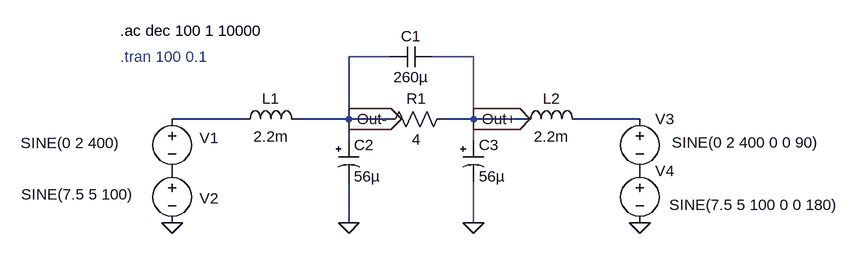
[diagram p0: schematic filterSim.asc]
filterSim.asc, the LTspice schematic file:
Version 4
SHEET 1 1072 680
WIRE 352 208 288 208
WIRE 480 208 416 208
WIRE 128 304 16 304
WIRE 288 304 288 208
WIRE 288 304 208 304
WIRE 352 304 288 304
WIRE 480 304 480 208
WIRE 480 304 432 304
WIRE 560 304 480 304
WIRE 736 304 640 304
WIRE 288 336 288 304
WIRE 480 336 480 304
WIRE 288 464 288 400
WIRE 480 464 480 400
FLAG 16 464 0
FLAG 736 464 0
FLAG 288 464 0
FLAG 480 464 0
FLAG 288 304 Out-
IOPIN 288 304 Out
FLAG 480 304 Out+
IOPIN 480 304 Out
SYMBOL ind 112 320 R270
WINDOW 0 32 56 VTop 2
WINDOW 3 5 56 VBottom 2
SYMATTR InstName L1
SYMATTR Value 2.2m
SYMBOL ind 544 320 R270
WINDOW 0 32 56 VTop 2
WINDOW 3 5 56 VBottom 2
SYMATTR InstName L2
SYMATTR Value 2.2m
SYMBOL cap 352 224 R270
WINDOW 0 32 32 VTop 2
WINDOW 3 0 32 VBottom 2
SYMATTR InstName C1
SYMATTR Value 260µ
SYMBOL polcap 272 336 R0
SYMATTR InstName C2
SYMATTR Value 56µ
SYMBOL polcap 464 336 R0
SYMATTR InstName C3
SYMATTR Value 56µ
SYMBOL res 448 288 R90
WINDOW 0 0 56 VBottom 2
WINDOW 3 32 56 VTop 2
SYMATTR InstName R1
SYMATTR Value 4
SYMBOL voltage 16 368 R0
WINDOW 0 42 58 Left 2
WINDOW 3 -232 52 Left 2
SYMATTR InstName V2
SYMATTR Value SINE(7.5 5 100)
SYMATTR Value2 AC 1
SYMBOL voltage 736 368 R0
WINDOW 3 45 68 Left 2
SYMATTR Value SINE(7.5 5 100 0 0 180)
SYMATTR InstName V4
SYMATTR Value2 AC 1 180
SYMBOL voltage 16 288 R0
WINDOW 0 42 45 Left 2
WINDOW 3 -233 53 Left 2
SYMATTR InstName V1
SYMATTR Value SINE(0 2 400)
SYMBOL voltage 736 288 R0
WINDOW 3 49 52 Left 2
SYMATTR Value SINE(0 2 400 0 0 90)
SYMATTR InstName V3
TEXT -64 168 Left 2 !.ac dec 100 1 10000
TEXT -64 208 Left 2 ;.tran 100 0.1

The netlist it stands for:
* filterSim.asc
L1 N001 Out- 2.2m
L2 Out+ N002 2.2m
C1 Out- Out+ 260µ
C2 Out- 0 56µ
C3 Out+ 0 56µ
R1 Out+ Out- 4
V2 P001 0 SINE(7.5 5 100) AC 1
V4 P002 0 SINE(7.5 5 100 0 0 180) AC 1 180
V1 N001 P001 SINE(0 2 400)
V3 N002 P002 SINE(0 2 400 0 0 90)
.ac dec 100 1 10000
* .tran 100 0.1
.backanno
.end

* Results of the author's LTspice run, read from the files saved beside the schematic
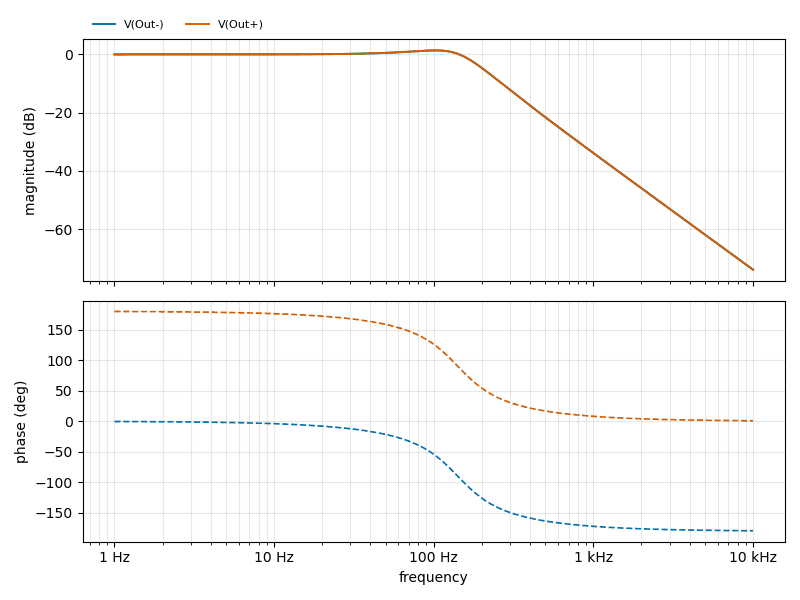
[diagram p1: AC Analysis of filterSim.asc, plotted from the saved traces]
* AC Analysis, 1 run:
*   V(Out-): -0.00 dB at 1 Hz, -73.98 dB at 10 kHz, peak 1.38 dB at 102.3 Hz, 3 dB below the peak at 165.8 Hz
*   V(Out+): -0.00 dB at 1 Hz, -73.98 dB at 10 kHz, peak 1.38 dB at 102.3 Hz, 3 dB below the peak at 165.8 Hz